# EAGLE schematic interface (EAGLE 9.5.1)
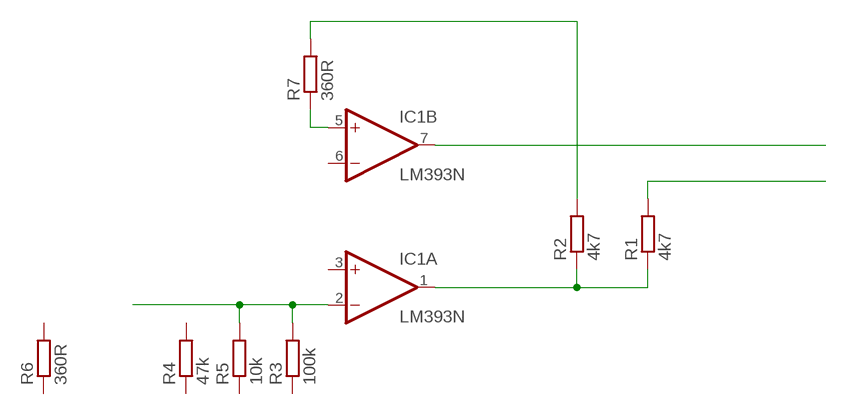
[diagram p0: schematic, sheet 1]

## Parts
IC1  LM393N  [DIL08]
R1  4k7  R-EU_R0805  [R0805]
R2  4k7  R-EU_R0805  [R0805]
R3  100k  R-EU_R0805  [R0805]
R4  47k  R-EU_R0805  [R0805]
R5  10k  R-EU_R0805  [R0805]
R6  360R  R-EU_R0805  [R0805]
R7  360R  R-EU_R0805  [R0805]

## Nets
N$1: IC1.1(A:OUT) R1.1 R2.1
N$2: R1.2
N$3: IC1.7(B:OUT)
N$4: IC1.2(A:-IN) R3.2 R5.2
N$5: IC1.5(B:+IN) R7.1
N$6: R2.2 R7.2
Unconnected: IC1.3(A:+IN) IC1.6(B:-IN) R3.1 R4.1 R4.2 R5.1 R6.1 R6.2

## Power pins joined to a net without a drawn wire
V+: IC1.8(P:V+)
V-: IC1.4(P:V-)

## Library data of the parts
IC1 = linear4:LM393: COMPARATOR
R1-R7 = resistor:R-EU_: RESISTOR, European symbol